# Altium schematic sheet Gould.SchDoc
size Letter; CompanyName: Ploopy Corporation; Organization: Ploopy Corporation; Address1: Suite 226, 137-1140 Burnhamthorpe Road W; Address2: Mississauga; Address3: Ontario; Address4: Canada L5C 0A3; DocumentNumber: 1; Revision: R1.007; SheetNumber: 1; SheetTotal: 11
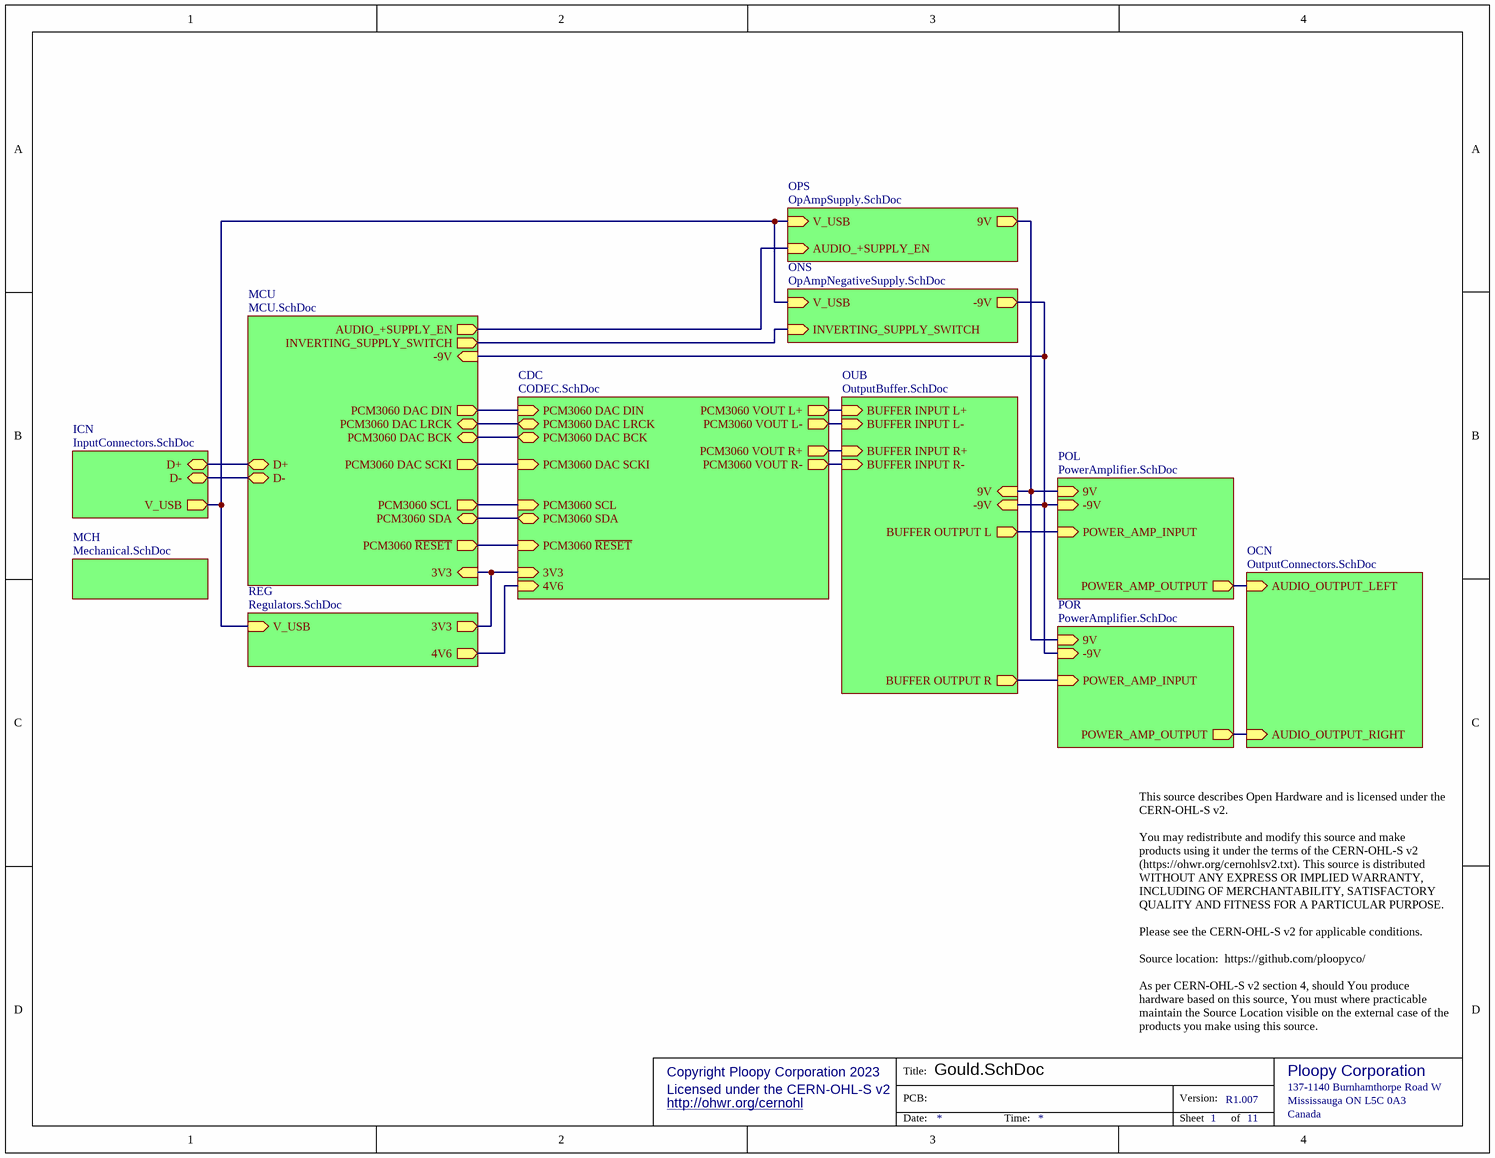
[diagram p0: Gould.SchDoc]

## Sub-sheets
CDC = CODEC.SchDoc: PCM3060 DAC DIN (in), PCM3060 SDA (bidir), PCM3060 DAC LRCK (bidir), PCM3060 VOUT L+ (out), PCM3060 VOUT R+ (out), PCM3060 SCL (in), PCM3060 DAC BCK (bidir), PCM3060 ~{RESET} (in), 3V3 (in), 4V6 (in), PCM3060 VOUT L- (out), PCM3060 VOUT R- (out), PCM3060 DAC SCKI (in)
ICN = InputConnectors.SchDoc: V_USB (out), D+ (bidir), D- (bidir)
MCH = Mechanical.SchDoc: no entries
MCU = MCU.SchDoc: D+ (bidir), D- (bidir), 3V3 (in), PCM3060 DAC DIN (out), PCM3060 SDA (bidir), PCM3060 DAC LRCK (bidir), PCM3060 SCL (out), PCM3060 DAC BCK (bidir), PCM3060 ~{RESET} (out), INVERTING_SUPPLY_SWITCH (out), -9V (in), PCM3060 DAC SCKI (out), AUDIO_+SUPPLY_EN (out)
OCN = OutputConnectors.SchDoc: AUDIO_OUTPUT_LEFT (in), AUDIO_OUTPUT_RIGHT (in)
ONS = OpAmpNegativeSupply.SchDoc: V_USB (in), -9V (out), INVERTING_SUPPLY_SWITCH (in)
OPS = OpAmpSupply.SchDoc: V_USB (in), 9V (out), AUDIO_+SUPPLY_EN (in)
OUB = OutputBuffer.SchDoc: -9V (in), 9V (in), BUFFER OUTPUT R (out), BUFFER INPUT R- (in), BUFFER INPUT R+ (in), BUFFER INPUT L- (in), BUFFER OUTPUT L (out), BUFFER INPUT L+ (in)
POL = PowerAmplifier.SchDoc: POWER_AMP_INPUT (in), POWER_AMP_OUTPUT (out), -9V (in), 9V (in)
POR = PowerAmplifier.SchDoc: POWER_AMP_INPUT (in), POWER_AMP_OUTPUT (out), -9V (in), 9V (in)
REG = Regulators.SchDoc: 3V3 (out), V_USB (in), 4V6 (out)

## Nets
(unnamed): sheet ICN/V_USB, sheet OPS/V_USB, sheet REG/V_USB, sheet ONS/V_USB
(unnamed): sheet ICN/D+, sheet MCU/D+
(unnamed): sheet ICN/D-, sheet MCU/D-
(unnamed): sheet OPS/9V, sheet POL/9V, sheet POR/9V, sheet OUB/9V
(unnamed): sheet OPS/AUDIO_+SUPPLY_EN, sheet MCU/AUDIO_+SUPPLY_EN
(unnamed): sheet OCN/AUDIO_OUTPUT_LEFT, sheet POL/POWER_AMP_OUTPUT
(unnamed): sheet OCN/AUDIO_OUTPUT_RIGHT, sheet POR/POWER_AMP_OUTPUT
(unnamed): sheet POL/POWER_AMP_INPUT, sheet OUB/BUFFER OUTPUT L
(unnamed): sheet POL/-9V, sheet POR/-9V, sheet MCU/-9V, sheet OUB/-9V, sheet ONS/-9V
(unnamed): sheet POR/POWER_AMP_INPUT, sheet OUB/BUFFER OUTPUT R
(unnamed): sheet MCU/3V3, sheet CDC/3V3, sheet REG/3V3
(unnamed): sheet MCU/PCM3060 DAC DIN, sheet CDC/PCM3060 DAC DIN
(unnamed): sheet MCU/PCM3060 SDA, sheet CDC/PCM3060 SDA
(unnamed): sheet MCU/PCM3060 DAC LRCK, sheet CDC/PCM3060 DAC LRCK
(unnamed): sheet MCU/PCM3060 SCL, sheet CDC/PCM3060 SCL
(unnamed): sheet MCU/PCM3060 DAC BCK, sheet CDC/PCM3060 DAC BCK
(unnamed): sheet MCU/PCM3060 ~{RESET}, sheet CDC/PCM3060 ~{RESET}
(unnamed): sheet MCU/INVERTING_SUPPLY_SWITCH, sheet ONS/INVERTING_SUPPLY_SWITCH
(unnamed): sheet MCU/PCM3060 DAC SCKI, sheet CDC/PCM3060 DAC SCKI
(unnamed): sheet CDC/PCM3060 VOUT L+, sheet OUB/BUFFER INPUT L+
(unnamed): sheet CDC/PCM3060 VOUT R+, sheet OUB/BUFFER INPUT R+
(unnamed): sheet CDC/4V6, sheet REG/4V6
(unnamed): sheet CDC/PCM3060 VOUT L-, sheet OUB/BUFFER INPUT L-
(unnamed): sheet CDC/PCM3060 VOUT R-, sheet OUB/BUFFER INPUT R-

## Notes on the sheet
- This source describes Open Hardware and is licensed under the CERN-OHL-S v2.
  You may redistribute and modify this source and make products using it under the terms of the CERN-OHL-S v2 (https://ohwr.org/cernohlsv2.txt). This source is distributed WITHOUT ANY EXPRESS OR IMPLIED WARRANTY, INCLUDING OF MERCHANTABILITY, SATISFACTORY QUALITY AND FITNESS FOR A PARTICULAR PURPOSE.
  Please see the CERN-OHL-S v2 for applicable conditions.
  Source location:  https://github.com/ploopyco/
  As per CERN-OHL-S v2 section 4, should You produce hardware based on this source, You must where practicable maintain the Source Location visible on the external case of the products you make using this source.
- Copyright Ploopy Corporation 2023
- Licensed under the CERN-OHL-S v2
- http://ohwr.org/cernohl
- Title:
- PCB:
- Version:
- Ploopy Corporation
- Mississauga ON L5C 0A3
- 137-1140 Burnhamthorpe Road W
- Date:
- Time:
- Sheet
- of
- Canada